# Altium schematic sheet Microcontroller.SchDoc
size A; SheetNumber: 3; SheetTotal: 3
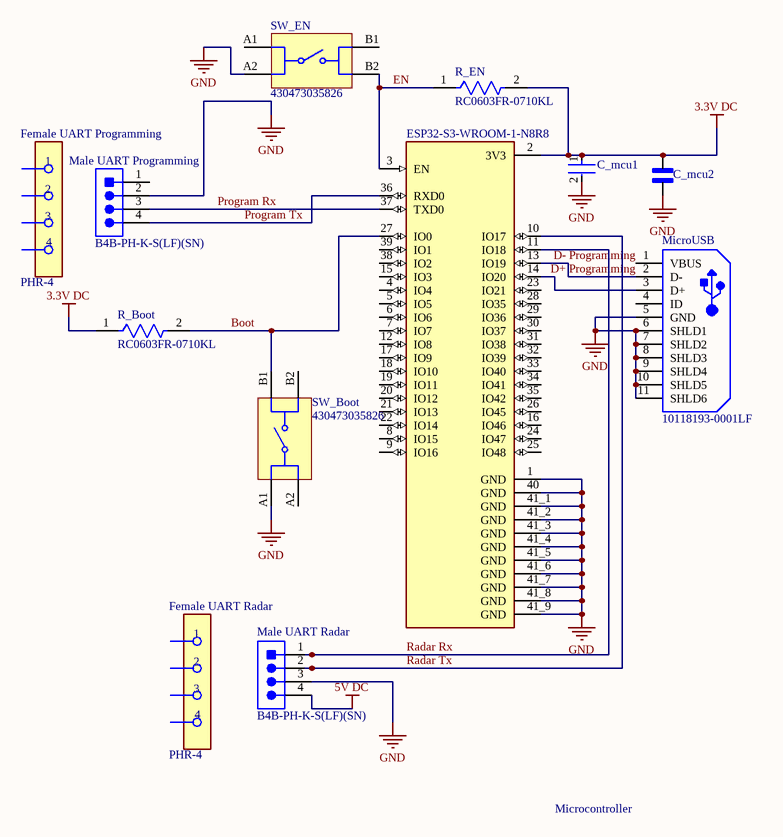
[diagram p0: Microcontroller.SchDoc]

## Parts
C_mcu1  C0603C104K4RAC7411  [FP-C0603C-CF-MFG]  (value not drawn)
C_mcu2  MSASE21GBB5226MTNA01  [CAPC2012X145N]  (value not drawn)
ESP32-S3-WROOM-1-N8R8  (no value)  [XCVR_ESP32S3WROOM1N8R8]
Female_UART_Programming  PHR-4  [FP-PHR-4-MFG]
Female_UART_Radar  PHR-4  [FP-PHR-4-MFG]
Male_UART_Programming  B4B-PH-K-S(LF)(SN)  [JST-B4B-PH-K-S_V]
Male_UART_Radar  B4B-PH-K-S(LF)(SN)  [JST-B4B-PH-K-S_V]
MicroUSB  10118193-0001LF  [FCI-10118193-0001LF-5_V]
R_Boot  RC0603FR-0710KL  [FP-RC0603-0_55-IPC_C]
R_EN  RC0603FR-0710KL  [FP-RC0603-0_55-IPC_C]
SW_Boot  430473035826  [430473035826]
SW_EN  430473035826  [430473035826]

## Nets
3.3V DC: C_mcu1.1 C_mcu2.2 ESP32-S3-WROOM-1-N8R8.2(3V3) R_Boot.1 R_EN.2
5V DC: Male_UART_Radar.4
GND: C_mcu1.2 C_mcu2.1 ESP32-S3-WROOM-1-N8R8.1(GND) ESP32-S3-WROOM-1-N8R8.40(GND) ESP32-S3-WROOM-1-N8R8.41_1(GND) ESP32-S3-WROOM-1-N8R8.41_2(GND) ESP32-S3-WROOM-1-N8R8.41_3(GND) ESP32-S3-WROOM-1-N8R8.41_4(GND) ESP32-S3-WROOM-1-N8R8.41_5(GND) ESP32-S3-WROOM-1-N8R8.41_6(GND) ESP32-S3-WROOM-1-N8R8.41_7(GND) ESP32-S3-WROOM-1-N8R8.41_8(GND) ESP32-S3-WROOM-1-N8R8.41_9(GND) Male_UART_Programming.2 Male_UART_Radar.3 MicroUSB.5(GND) MicroUSB.6(SHLD1) MicroUSB.7(SHLD2) MicroUSB.8(SHLD3) MicroUSB.9(SHLD4) MicroUSB.10(SHLD5) MicroUSB.11(SHLD6) SW_Boot.A1 SW_EN.A2
Boot: ESP32-S3-WROOM-1-N8R8.27(IO0) R_Boot.2 SW_Boot.B1
D+ Programming: ESP32-S3-WROOM-1-N8R8.14(IO20) MicroUSB.3(D+)
D- Programming: ESP32-S3-WROOM-1-N8R8.13(IO19) MicroUSB.2(D-)
EN: ESP32-S3-WROOM-1-N8R8.3(EN) R_EN.1 SW_EN.B2
Program Rx: ESP32-S3-WROOM-1-N8R8.37(TXD0) Male_UART_Programming.3
Program Tx: ESP32-S3-WROOM-1-N8R8.36(RXD0) Male_UART_Programming.4
Radar Rx: ESP32-S3-WROOM-1-N8R8.11(IO18) Male_UART_Radar.1
Radar Tx: ESP32-S3-WROOM-1-N8R8.10(IO17) Male_UART_Radar.2

Not connected (* = marked no-connect by the designer): ESP32-S3-WROOM-1-N8R8 4(IO4) 5(IO5) 6(IO6) 7(IO7) 8(IO15) 9(IO16) 12(IO8) 15(IO3) 16(IO46) 17(IO9) 18(IO10) 19(IO11) 20(IO12) 21(IO13) 22(IO14) 23(IO21) 24(IO47) 25(IO48) 26(IO45) 28(IO35) 29(IO36) 30(IO37) 31(IO38) 32(IO39) 33(IO40) 34(IO41) 35(IO42) 38(IO2) 39(IO1); Male_UART_Programming 1; MicroUSB 1(VBUS) 4(ID); SW_Boot A2 B2; SW_EN A1 B1

## Notes on the sheet
- Microcontroller
- (in symbol CMP-002-00072-1) 1; 2; 3; 4

## Library data of the parts
C_mcu1 = CMP-2006-03724-3: CAP CER 0.1UF 16V X7R 0603; Manufacturer: KEMET; Value: 0.10 μF; Tolerance: 0.1; Temperature Coefficient: 30ppm/°C; Automotive Grade: Grade 1; Temperature Range High: +125°C; Category: Cap; Temperature: -55°C to +125°C; RoHS: TRUE; Temperature Characteristic: X7R; Height: 0.87mm; Lead Free: Yes; Automotive: Yes; Digikey Description: CAP CER 0.1UF 16V X7R 0603; Device Class L2: Capacitors; Mouser Description: Cap Ceramic 0.1uF 16V X7R 10% SMD 0603 125°C Paper T/R; Capacitance: 0.10 μF; Device Class L1: Passive Components; Temperature Range Low: -55°C; ComponentLink2Description: Datasheet; Material: Ceramic; ComponentLink2URL: https://api.kemet.com/component-edge/download/datasheet/C0603C100J5GACAUTO.pdf; Voltage Rating: 16 V; Octopart: https://octopart.com/c0603c104k4rac7411-kemet-3919501; Device Class L3: Ceramic Capacitors; Manufacturer Part Number: C0603C104K4RAC7411; Package: C0603C-CF
C_mcu2 = MSASE21GBB5226MTNA01: MF: {'manufacturer': u'Taiyo Yuden'}; Package: None; Price: None; Value: *; MP: MSASE21GBB5226MTNA01; Availability: Unavailable
ESP32-S3-WROOM-1-N8R8 = CMP-003-000001-1: Bluetooth, WiFi 802.11b/g/n, Bluetooth v5.0 Transceiver Module 2.4GHz PCB Trace Surface Mount; MF: Espressif Systems; MP: ESP32-S3-WROOM-1-N8R8; Source: ESP32-S3-WROOM-1-N8R8.SchLib; Component Type: Standard; Design Item ID: ESP32-S3-WROOM-1-N8R8; Price: None; Check_prices: https://www.snapeda.com/parts/ESP32-S3-WROOM-1-N8R8/Espressif+Systems/view-part/?ref=eda; Package: None; Pin Count: 49; Value: *; SnapEDA_Link: https://www.snapeda.com/parts/ESP32-S3-WROOM-1-N8R8/Espressif+Systems/view-part/?ref=snap; Availability: In Stock; Purchase-URL: https://pricing.snapeda.com/search?q=ESP32-S3-WROOM-1-N8R8&ref=eda
Female_UART_Programming Female_UART_Radar = CMP-002-00072-1: Connector Housing, PH Series, 4 Positions, 2.00mm, Crimp, Detent Lock, Natural
Male_UART_Programming Male_UART_Radar = CMP-002-00073-1: Connector Header, PH Series, 4 Position, 2.00mm, Solder, Through Hole, Tin, Natural
MicroUSB = CMP-2000-05119-1: Micro USB B Type Receptacle, -55 to 85 degC, 5-Pin SMD, RoHS, Tape and Reel; Manufacturer: FCI; Insulation Resistance: 1000MOhms; Gender: Female; Current Rating: 1.8A; Number of Contacts: 5Contact; Connector Type: MicroUSBTypeBreceptacle; Mounting Angle: Right; Datasheet Version: Rev. C, 05/2015; Packaging: Reel; Product Category: USBConnectors; Standard: USB2.0; Factory Pack Quantity: 1200; Operating Temperature Range: -55Cto+85C; Termination Style: SMD/SMT; Datasheet URL: http://datasheet.octopart.com/10118193-0001LF-FCI-datasheet-55953155.pdf; Contact Material: CopperAlloy; RoHS: Details; Contact Plating: Gold; Flammability Rating: UL94V-0; Manufacturer URL: http://www.fci.com/; Brand: FCI; Product: MicroUSBTypeBConnectors; Color: Black
R_Boot R_EN = CMP-2100-03664-2: RES 10K OHM 1% 1/10W 0603; Voltage Rating: 75V; Voltage Rating (DC): 50V; Resistance: 10kR; Power Rating: 100mW; Temperature Coefficient: 100ppm/°C; Depth: 0.8mm; Termination: SMD/SMT; Resistor Type: Thick Film; Series: RC; Construction: Rectangular; Features: Moisture Resistant; Packaging: Tape and Reel; Min Operating Temperature: -55°C; Number of Terminations: 2; Lead Pitch: 0.3mm; RoHS Compliant: Yes; Case/Package: 0603; Resistance Tolerance: 1%; Military Standard: Not; Weight: 7.1E-05oz; Number of Pins: 2; Tolerance: 1%; Length: 1.6mm; Case Code (Imperial): 0603; Lead Free: Lead Free; Width: 0.8mm; Max Power Dissipation: 100mW; Height: 0.45mm; Max Operating Temperature: 155°C; Case Code (Metric): 1608; Size Code: 0603
SW_Boot SW_EN = CMP-1455-00006-3: Switch Tactile Spst-no 0.05A 12V; Throw Configuration: SPST; Switch Travel: 250µm; Actuator Material: Liquid Crystal Polymer, Polymer; Current Rating: 50mA; Insulation Resistance: 100MΩ; Illumination Type: Non-Illuminated; Switch Function: Off-Mom; Mechanical Life: 500kcycles; Voltage Rating: 12V; Max Operating Temperature: 85°C; Packaging: Tape and Reel; RoHS: Compliant; Height: 3.5mm; Contact Plating: Silver; Mount: Surface Mount; Min Operating Temperature: -40°C